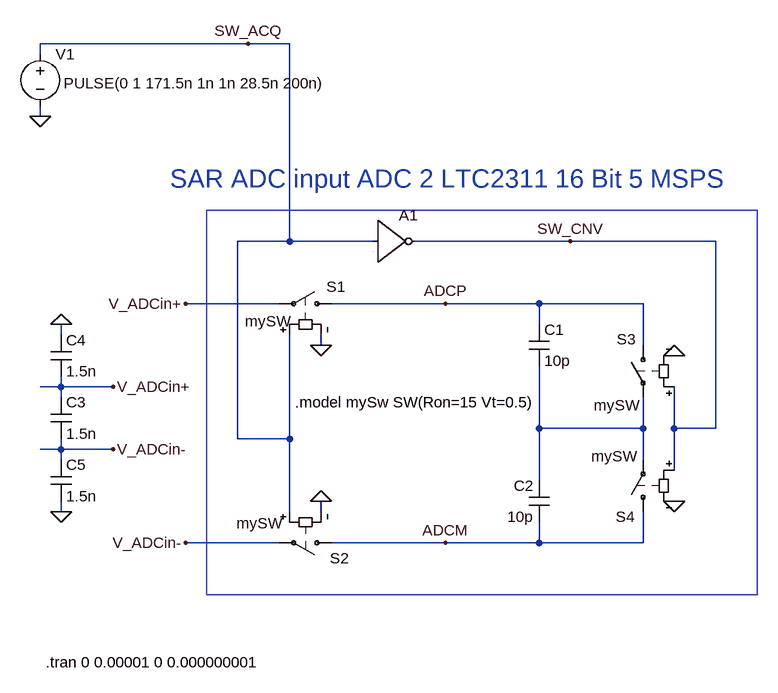
[diagram p0: schematic LTC2311_Rev04.asc]
LTC2311_Rev04.asc, the LTspice schematic file:
Version 4
SHEET 1 1768 760
WIRE 528 -208 208 -208
WIRE 592 -208 528 -208
WIRE 208 -192 208 -208
WIRE 208 -96 208 -112
WIRE 592 96 592 -208
WIRE 592 96 512 96
WIRE 720 96 592 96
WIRE 1024 96 784 96
WIRE 1248 96 1024 96
WIRE 576 192 432 192
WIRE 832 192 656 192
WIRE 976 192 832 192
WIRE 1136 192 976 192
WIRE 976 224 976 192
WIRE 240 240 240 224
WIRE 640 256 640 240
WIRE 1136 256 1136 192
WIRE 240 320 240 304
WIRE 240 320 208 320
WIRE 320 320 240 320
WIRE 240 336 240 320
WIRE 976 384 976 288
WIRE 1136 384 1136 336
WIRE 1136 384 976 384
WIRE 1184 384 1184 320
WIRE 1248 384 1248 96
WIRE 1248 384 1184 384
WIRE 512 400 512 96
WIRE 592 400 592 240
WIRE 592 400 512 400
WIRE 240 416 240 400
WIRE 240 416 208 416
WIRE 320 416 240 416
WIRE 240 432 240 416
WIRE 1136 432 1136 384
WIRE 1184 448 1184 384
WIRE 976 464 976 384
WIRE 240 512 240 496
WIRE 592 512 592 400
WIRE 640 512 640 496
WIRE 576 560 432 560
WIRE 832 560 656 560
WIRE 976 560 976 528
WIRE 976 560 832 560
WIRE 1136 560 1136 512
WIRE 1136 560 976 560
FLAG 528 -208 SW_ACQ
FLAG 832 192 ADCP
FLAG 832 560 ADCM
FLAG 640 256 0
FLAG 640 496 0
FLAG 1184 272 0
FLAG 1184 496 0
FLAG 1024 96 SW_CNV
FLAG 432 192 V_ADCin+
FLAG 432 560 V_ADCin-
FLAG 208 -96 0
FLAG 240 224 0
FLAG 240 512 0
FLAG 320 320 V_ADCin+
FLAG 320 416 V_ADCin-
SYMBOL cap 960 288 M180
WINDOW 0 24 56 Left 2
WINDOW 3 24 8 Left 2
SYMATTR InstName C1
SYMATTR Value 10p
SYMBOL sw 672 192 M270
WINDOW 3 -27 149 VLeft 2
WINDOW 0 26 23 VLeft 2
SYMATTR Value mySW
SYMATTR InstName S1
SYMBOL cap 992 464 M0
SYMATTR InstName C2
SYMATTR Value 10p
SYMBOL sw 672 560 R90
WINDOW 3 -30 162 VLeft 2
WINDOW 0 24 18 VLeft 2
SYMATTR Value mySW
SYMATTR InstName S2
SYMBOL sw 1136 240 M0
WINDOW 3 5 108 Left 2
WINDOW 0 11 7 Left 2
SYMATTR Value mySW
SYMATTR InstName S3
SYMBOL Digital\\inv 720 32 R0
SYMATTR InstName A1
SYMBOL sw 1136 528 R180
WINDOW 3 9 101 Left 2
WINDOW 0 13 8 Left 2
SYMATTR Value mySW
SYMATTR InstName S4
SYMBOL cap 224 336 R0
SYMATTR InstName C3
SYMATTR Value 1.5n
SYMBOL cap 224 240 R0
SYMATTR InstName C4
SYMATTR Value 1.5n
SYMBOL cap 224 432 R0
SYMATTR InstName C5
SYMATTR Value 1.5n
SYMBOL voltage 208 -208 R0
WINDOW 3 36 61 Left 2
WINDOW 123 0 0 Left 2
WINDOW 39 0 0 Left 2
SYMATTR Value PULSE(0 1 171.5n 1n 1n 28.5n 200n)
SYMATTR InstName V1
TEXT 600 344 Left 2 !.model mySw SW(Ron=15 Vt=0.5)
TEXT 408 0 Left 4 ;SAR ADC input ADC 2 LTC2311 16 Bit 5 MSPS
TEXT 216 744 Left 2 !.tran 0 0.00001 0 0.000000001
RECTANGLE Normal 1312 640 464 48

The netlist it stands for:
* LTC2311_Rev04.asc
C1 N001 ADCP 10p
S1 ADCP V_ADCin+ SW_ACQ 0 mySW
C2 N001 ADCM 10p
S2 ADCM V_ADCin- SW_ACQ 0 mySW
S3 ADCP N001 SW_CNV 0 mySW
A1 SW_ACQ 0 0 0 0 SW_CNV 0 0 BUF
S4 ADCM N001 SW_CNV 0 mySW
C3 V_ADCin+ V_ADCin- 1.5n
C4 0 V_ADCin+ 1.5n
C5 V_ADCin- 0 1.5n
V1 SW_ACQ 0 PULSE(0 1 171.5n 1n 1n 28.5n 200n)
.model mySw SW(Ron=15 Vt=0.5)
* SAR ADC input ADC 2 LTC2311 16 Bit 5 MSPS
.tran 0 0.00001 0 0.000000001
.backanno
.end